# EAGLE design AST1006 (EAGLE 6.3)
DATABASE: ./../../../../../Components/TinyCircuits_Part_Database.txt
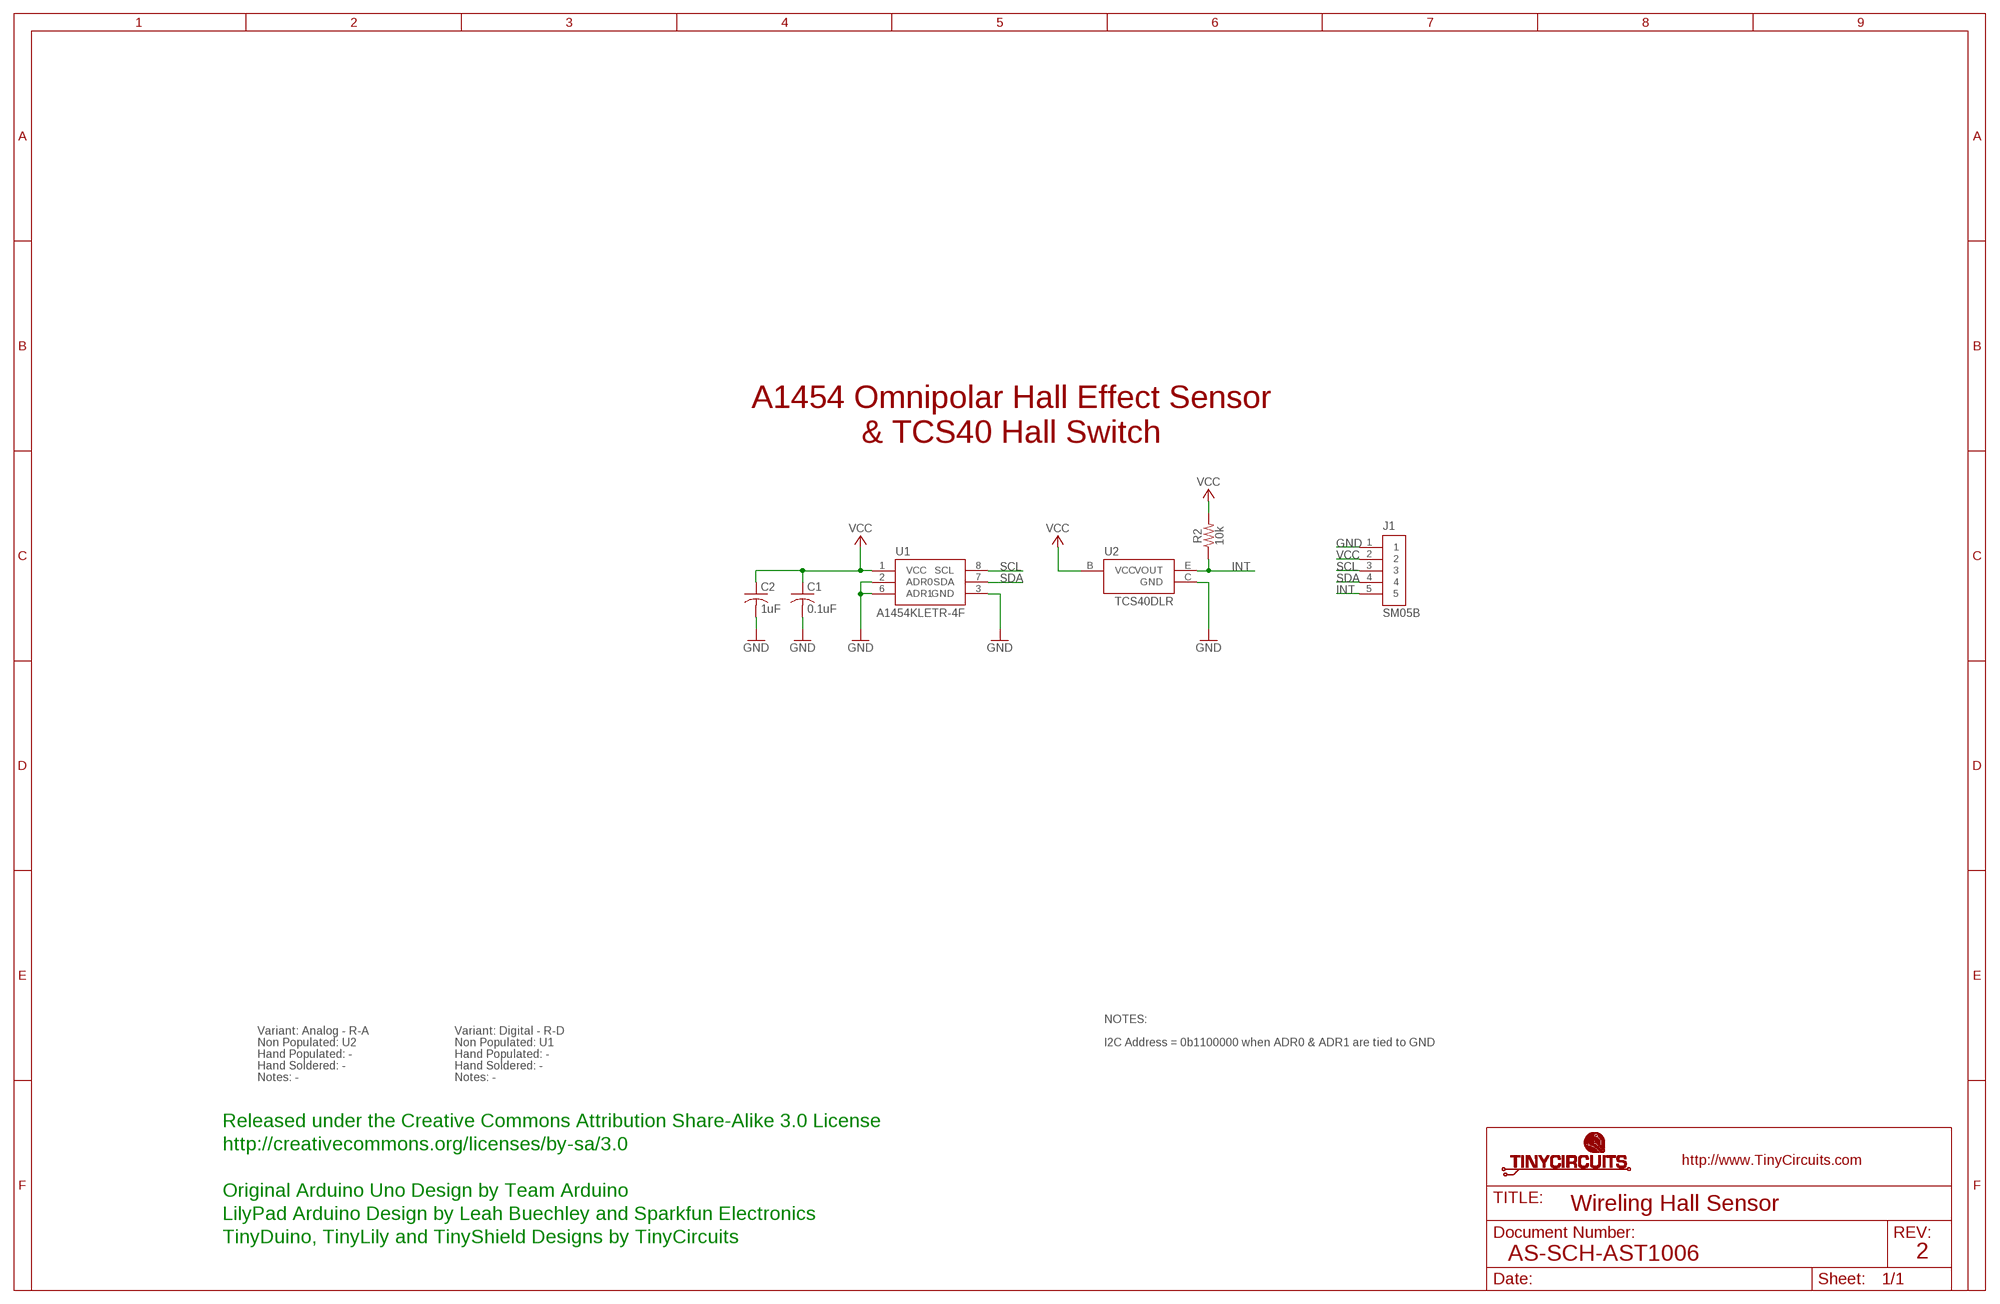
[diagram p0: schematic, sheet 1]

## Parts
C1  0.1uF  AS-ITM-00008  [C0402]
C2  1uF  AS-ITM-00410  [C0603]
J1  SM05B  AS-ITM-00340EDGE  [JST_SH_5X1_EDGE]
R2  10k  AS-ITM-00032  [0402]
U1  A1454KLETR-4F  AS-ITM-00361  [TSSOP(8)]
U2  TCS40DLR  AS-ITM-00362C  [SOT23A]

## Nets
GND: C1.2 C2.2 J1.1 U1.2(ADR0) U1.3(GND) U1.6(ADR1) U2.C(GND)
INT: J1.5 R2.1 U2.E(VOUT)
SCL: J1.3 U1.8(SCL)
SDA: J1.4 U1.7(SDA)
VCC: C1.1 C2.1 J1.2 R2.2 U1.1(VCC) U2.B(VCC)

## Notes on the sheet
- A1454 Omnipolar Hall Effect Sensor
- & TCS40 Hall Switch
- NOTES:
- Variant: Analog - R-A | Variant: Digital - R-D
- Non Populated: U2 | Non Populated: U1 | I2C Address = 0b1100000 when ADR0 & ADR1 are tied to GND
- Hand Populated: - | Hand Populated: -
- Hand Soldered: - | Hand Soldered: -
- Notes: - | Notes: -
- Released under the Creative Commons Attribution Share-Alike 3.0 License
- http://creativecommons.org/licenses/by-sa/3.0
- Original Arduino Uno Design by Team Arduino
- Wireling Hall Sensor
- LilyPad Arduino Design by Leah Buechley and Sparkfun Electronics
- TinyDuino, TinyLily and TinyShield Designs by TinyCircuits
- AS-SCH-AST1006 | 2

## Library data of the parts
C1 = tinycircuits:AS-ITM-00008: CAP CER 0.1UF 16V 10% X5R 0402; PARTNO: AS-ITM-00008
C2 = tinycircuits:AS-ITM-00410: CAP CER 1UF 10V X5R 0603; PARTNO: AS-ITM-00410
J1 = tinycircuits:AS-ITM-00340: CONN HEADER SH 5POS SIDE 1MM TIN; PARTNO: AS-ITM-00340; PNPROTATION: 180
R2 = tinycircuits:AS-ITM-00032: RES 10.0K OHM 1/16W 1% 0402 SMD; PARTNO: AS-ITM-00032; VALUE: 10.0K
U1 = tinycircuits:AS-ITM-00361: HALL SENSOR LINEAR I2C 8TSSOP; PARTNO: AS-ITM-00361
U2 = tinycircuits:AS-ITM-00362: MAGNETIC SWITCH OMNIPOLAR SC59; PARTNO: AS-ITM-00362

## Net classes
2 gnd: width 0.305 mm, drill 0.559 mm, clearance 0.254 mm

## Board
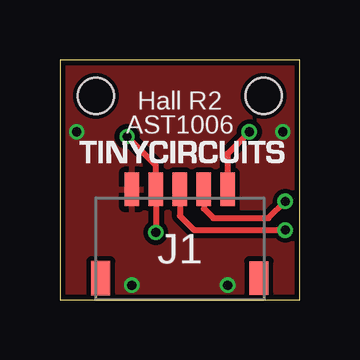
[diagram p1: board, top side]
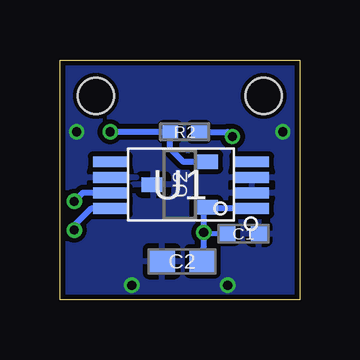
[diagram p2: board, bottom side, seen from below]

Size 10 x 10 mm. Coordinates in mm from the lower left corner, seen from the top.
Outline: 0,0 10,0 10,10 0,10 0,0
Copper layers (1*16): Top 0.035mm / dielectric 1.5mm / Bottom 0.035mm
Design rules "default *": minimum track width 8mil, minimum drill 15mil, track to track 8mil, track to pad 8mil, pad to pad 8mil, via to via 8mil, smd to smd 8mil, copper to edge 8mil, drill to drill 8mil, minimum pad ring 8mil, minimum via ring 5mil, stop-mask expansion 4mil, vias tented up to drill 25mil, thermal gap 10mil
Holes 1.5 mm at 1.5,8.5 8.5,8.5

### Footprints (pad centres in the part's own frame; a part is rotated, then mirrored left to right if it is on the bottom)
C0402 = smd 0.65 x 0.6: 1 -0.65,0; 2 0.65,0
C0603 = smd 1.1 x 1: 1 -0.85,0; 2 0.85,0
JST_SH_5X1_EDGE = smd 0.6 x 1.4: 1 -2,2.475; 2 -1,2.475; 3 0,2.475; 4 1,2.475; 5 2,2.475 | smd 0.8 x 1.4: PAD1 -3.3,-1.225; PAD2 3.3,-1.225
0402 = smd 0.65 x 0.55: 1 -0.6,0; 2 0.6,0
TSSOP(8) = smd 1.45 x 0.45: 1 -3,1; 2 -3,0.35; 3 -3,-0.3; 4 -3,-0.95; 5 2.9,-0.95; 6 2.9,-0.3; 7 2.9,0.35; 8 2.9,1
SOT23A = smd 0.6 x 1: B -0.95,-1.1; C 0,1.1; E 0.95,-1.1

### Placement (x,y rotation side)
C1  2.35,2.75 0 bottom
C2  4.9,1.6 180 bottom
J1  5,2.12 0 top
R2  4.8,7 0 bottom
U1  5,4.8 180 bottom
U2  5,4.8 90 bottom
U$1  [DOCFIELD-TINYCIRCUITS-PCB]  19,-10 0 top  (outside the outline)

### Tracks (layer width: path | path; a pad name or v marks a point on that pad's centre or on a via)
GND  (via drill 0.38)
  other vias: 3,0.6 7,0.6 0.7,7 9.3,7
  pour Bottom: 0,10 10,10 10,0 0,0
  pour Top: 0,10 10,10 10,0 0,0
INT  (via drill 0.38)
  Top 0.254: J1.5 7,6.1 v7.9,7
  Bottom 0.254: 7.85,7.05 v7.9,7 R2.1 5.4,6.3 4.85,5.75 U2.E
SCL  (via drill 0.38)
  Top 0.254: J1.3 5,3.5 5.6,2.9 v9.4,2.9
  Bottom 0.254: U1.8 8.7,3.8 9.4,3.1 v9.4,2.9
SDA  (via drill 0.38)
  Top 0.254: J1.4 6,3.8 6.4,3.4 8.7,3.4 v9.4,4.1
  Bottom 0.254: U1.7 9.05,4.45 v9.4,4.1
VCC  (via drill 0.38)
  Top 0.254: v4,2.8 J1.2 4,5.6 v2.8,6.8
  Bottom 0.203: C1.1 4,2.75 v4,2.8
  Bottom 0.254: C2.1 4,2.3 v4,2.8 4,3.75 U2.B 3.85,3.8 U1.1 1.95,3.75 | R2.2 3,7 v2.8,6.8

### Text on the board
tPlace: Hall R2 | AST1006
Document: FABRICATION DRAWING | NOTES: | 1. PRINTED CIRCUIT BOARD MADE FROM NEMA GRADE FR-4 EPOXY LAMINATE | WITH 1 OUNCE COPPER PLATING AND .024 THICKNESS. | 2. ALL DIMENSIONS ARE GIVEN IN MILLIMETERS. | 3. CIRCUIT PATHS ARE FOR REFERENCE ONLY. | 4. HOLE SIZES SHOWN ARE FINISHED DIAMETERS AFTER PLATING. | 5. BOARD PLATED USING REFLOW OR SIMILAR METHOD. | 6. BOARD TO HAVE BLUE SOLDER MASK ON PLATED SURFACES USING WET FILM | 7. SILKSCREEN BOARD USING WHITE INK. | SR100 OR SR1010 EPOXY. EQUIVALENT WET OR DRY FILM MAY BE USED. | 8. THE FOLLOWING INFORMATION APPLIES TO THIS BOARD: | * 2 COPPER LAYERS | * .024 BOARD THICKNESS | * REQUIRES TOP SIDE SILKSCREEN | Released under the Creative Commons Attribution Share-Alike 3.0 License | http://creativecommons.org/licenses/by-sa/3.0 | Original Arduino Uno Design by Team Arduino | LilyPad Arduino Design by Leah Buechley and Sparkfun Electronics | TinyDuino, TinyLily and TinyShield Designs by TinyCircuits | Wireling Hall Sensor | AS-PCB-AST1006 | 2